# Altium project BJT_CE_Amp.PrjPcb
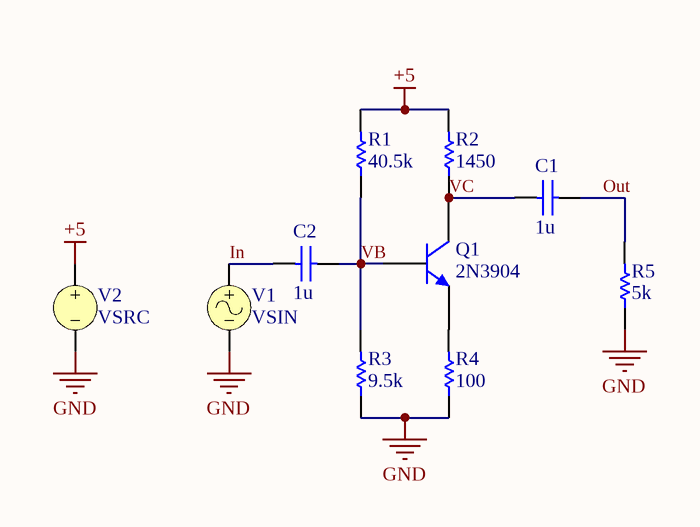
[diagram p0: bjtceamp.SchDoc]
1 sheet, 10 parts. Net scope: global (net labels, ports and power ports of the same name join across sheets).

## Sheet bjtceamp.SchDoc
size A4

### Parts
C1  1u  [RAD-0.3]
C2  1u  [RAD-0.3]
Q1  2N3904  [TO-92A]
R1  40.5k  [AXIAL-0.3]
R2  1450  [AXIAL-0.3]
R3  9.5k  [AXIAL-0.3]
R4  100  [AXIAL-0.3]
R5  5k  [AXIAL-0.3]
V1  VSIN
V2  VSRC

### Nets
+5: R1.2 R2.2 V2.1
GND: R3.1 R4.1 R5.1 V1.2 V2.2
In: C2.2 V1.1
Out: C1.1 R5.2
VB: C2.1 Q1.2(B) R1.1 R3.2
VC: C1.2 Q1.3(C) R2.1
NetQ1_1: Q1.1(E) R4.2

### Library data of the parts
C1 C2 = Cap: Capacitor; Published: 8-Jun-2000; LatestRevisionDate: 17-Jul-2002; LatestRevisionNote: Re-released for DXP Platform.; PackageReference: RAD-0.3; Publisher: Altium Limited; PackageDescription: Radial Cap, Thru-Hole; 2 Leads; 0.3 in Pin Spacing; Value: 1u
Q1 = 2N3904: NPN General Purpose Amplifier; Published: 8-Jun-2000; LatestRevisionDate: 15-Jan-2003; LatestRevisionNote: PCB Footprint 'BCY-W3/D4.7' replaced; DatasheetVersion: 1997; PackageVersion: Sep-1998; PackageReference: TO-92A; Publisher: Altium Limited; PackageDescription: TO, Flat Index; 3 In-Line, Axial Leads; Body Dia. 4.5mm; Leads 0.51 x 0.48 mm (max); ComponentLink1Description: Manufacturer Link; ComponentLink1URL: http://www.fairchildsemi.com/; ComponentLink2Description: Datasheet; ComponentLink2URL: http://www.fairchildsemi.com/ds/2N%2F2N3904.pdf
R1-R5 = Res1: Resistor; Published: 8-Jun-2000; LatestRevisionDate: 17-Jul-2002; LatestRevisionNote: Re-released for DXP Platform.; PackageReference: AXIAL-0.3; Publisher: Altium Limited; PackageDescription: Axial Device, Thru-Hole; 2 Leads; 0.3 in Pin Spacing
  R1: Value: 40.5k
  R2: Value: 1450
  R3: Value: 9.5k
  R4: Value: 100
  R5: Value: 5k
V1 = VSIN: Sinusoidal Voltage Source; Note: PCB Footprint - Not required; Published: 8-Jun-2000; LatestRevisionDate: 15-Nov-2004; LatestRevisionNote: Corrected Netlist.; PackageReference: Not Applicable; Publisher: Altium Limited
V2 = VSRC: Voltage Source; Note: PCB Footprint - Not required; Value: 5; Published: 8-Jun-2000; LatestRevisionDate: 17-Jul-2002; LatestRevisionNote: Re-released for DXP Platform.; PackageReference: Not Applicable; Publisher: Altium Limited